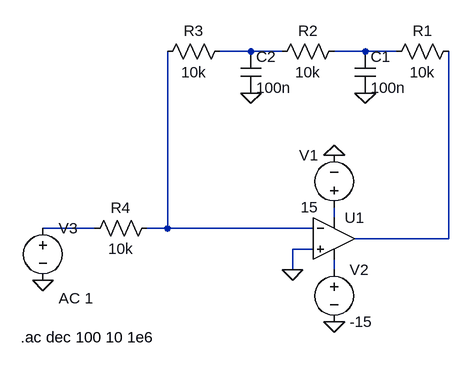
[diagram p0: schematic Ejercicio_17_EA_Jun_2011.asc]
Ejercicio_17_EA_Jun_2011.asc, the LTspice schematic file:
Version 4
SHEET 1 880 680
WIRE 112 -112 64 -112
WIRE 160 -112 112 -112
WIRE 288 -112 240 -112
WIRE 336 -112 288 -112
WIRE 240 144 240 128
WIRE -128 160 -208 160
WIRE -16 160 -16 -112
WIRE -16 160 -48 160
WIRE 208 160 -16 160
WIRE 416 176 416 -112
WIRE 416 176 272 176
WIRE 208 192 176 192
WIRE 176 224 176 192
WIRE 240 224 240 208
FLAG 240 48 0
FLAG 240 304 0
FLAG 176 224 0
FLAG 288 -48 0
FLAG 112 -48 0
FLAG -208 240 0
SYMBOL OpAmps\\UniversalOpAmp 240 176 R0
SYMATTR InstName U1
SYMBOL voltage 240 144 R180
WINDOW 0 24 96 Left 2
WINDOW 3 24 16 Left 2
WINDOW 123 0 0 Left 0
WINDOW 39 0 0 Left 0
SYMATTR InstName V1
SYMATTR Value 15
SYMBOL voltage 240 208 R0
WINDOW 123 0 0 Left 0
WINDOW 39 0 0 Left 0
SYMATTR InstName V2
SYMATTR Value -15
SYMBOL res 432 -128 R90
WINDOW 0 0 56 VBottom 2
WINDOW 3 32 56 VTop 2
SYMATTR InstName R1
SYMATTR Value 10k
SYMBOL cap 272 -112 R0
SYMATTR InstName C1
SYMATTR Value 100n
SYMBOL res 256 -128 R90
WINDOW 0 0 56 VBottom 2
WINDOW 3 32 56 VTop 2
SYMATTR InstName R2
SYMATTR Value 10k
SYMBOL cap 96 -112 R0
SYMATTR InstName C2
SYMATTR Value 100n
SYMBOL res 80 -128 R90
WINDOW 0 0 56 VBottom 2
WINDOW 3 32 56 VTop 2
SYMATTR InstName R3
SYMATTR Value 10k
SYMBOL res -32 144 R90
WINDOW 0 0 56 VBottom 2
WINDOW 3 32 56 VTop 2
SYMATTR InstName R4
SYMATTR Value 10k
SYMBOL voltage -208 144 R0
WINDOW 123 24 124 Left 2
WINDOW 39 0 0 Left 0
SYMATTR InstName V3
SYMATTR Value ""
SYMATTR Value2 AC 1
TEXT -242 328 Left 2 !.ac dec 100 10 1e6

The netlist it stands for:
* Ejercicio_17_EA_Jun_2011.asc
XU1 0 N005 N003 N007 N006 level1 Avol=1Meg GBW=10Meg Vos=0 En=0 Enk=0 In=0 Ink=0 Rin=500Meg  ; pins In+ In- V+ V- OUT
V1 N003 0 15
V2 N007 0 -15
R1 N006 N002 10k
C1 N002 0 100n
R2 N002 N001 10k
C2 N001 0 100n
R3 N001 N005 10k
R4 N005 N004 10k
V3 N004 0 AC 1
.ac dec 100 10 1e6
.lib UniversalOpAmp1.lib
.backanno
.end